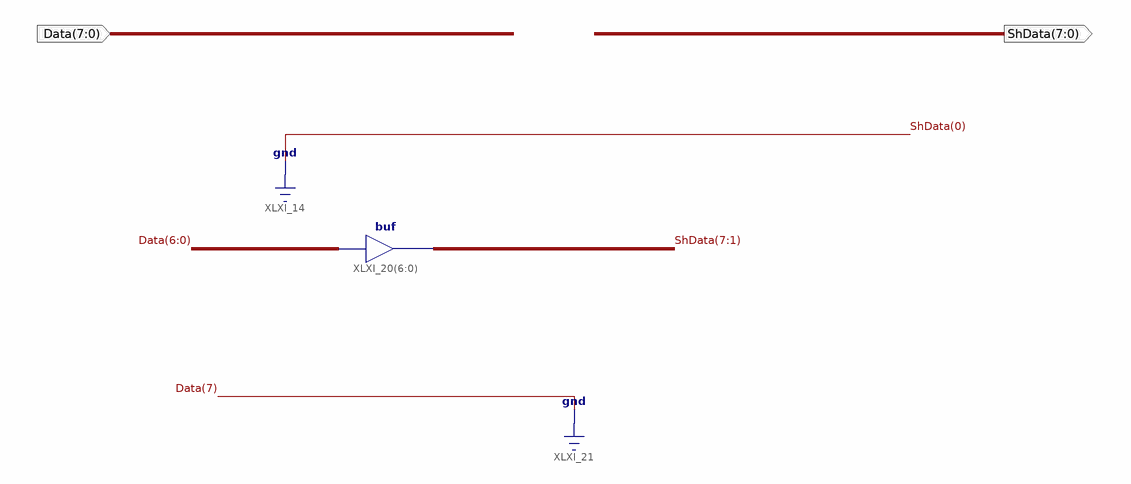
[diagram p0: schematic sheet 1]
// Xilinx ISE schematic SHL.sch (spartan6) as structural Verilog: 1 symbols, 2 ports
module SHL (
  input  [7:0] Data,
  output [7:0] ShData
);

  assign ShData[7:1] = Data[6:0];  // buf XLXI_20[6..0], 7 bits wide

  assign ShData[0] = 1'b0;
  // also tied to GND on the sheet: Data[7]
endmodule
